# Altium schematic sheet Sensors.SchDoc
size A4; SheetNumber: 1; SheetTotal: 1
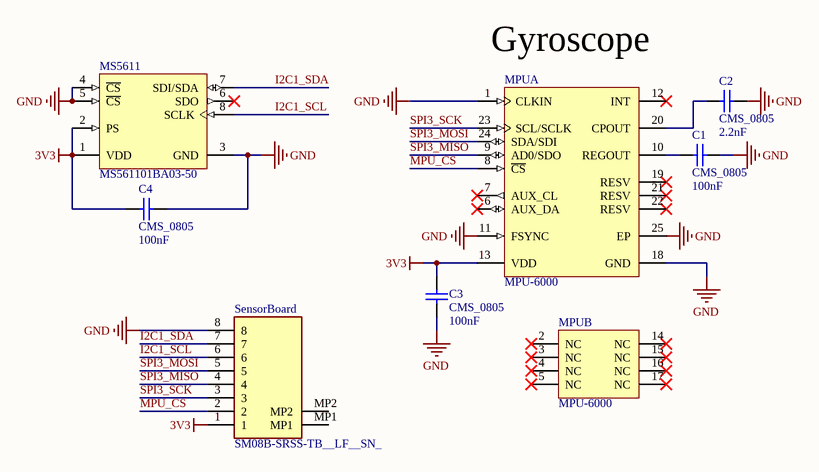
[diagram p0: Sensors.SchDoc]

## Parts
C1  value 100nF  [CONDENSATEUR_CMS_0805]  (hidden comment: CMS_0805)
C2  value 2.2nF  [CONDENSATEUR_CMS_0805]  (hidden comment: CMS_0805)
C3  value 100nF  [CONDENSATEUR_CMS_0805]  (hidden comment: CMS_0805)
C4  value 100nF  [CONDENSATEUR_CMS_0805]  (hidden comment: CMS_0805)
MPU  MPU-6000  [INSE-QFN-24_V]  (parts A,B of 2)
MS5611  MS561101BA03-50  [MSI-MS561101BA03-50-8_V]
SensorBoard  SM08B-SRSS-TB__LF__SN_  [SM08BSRSSTBLFSN]

## Nets
3V3: C3.2 C4.2 MPU.13(VDD) MS5611.1(VDD) MS5611.2(PS) SensorBoard.1
GND: C1.2 C2.2 C3.1 C4.1 MPU.1(CLKIN) MPU.11(FSYNC) MPU.18(GND) MPU.25(EP) MS5611.3(GND) MS5611.4(~{CS}) MS5611.5(~{CS}) SensorBoard.8
I2C1_SCL: MS5611.8(SCLK) SensorBoard.6
I2C1_SDA: MS5611.7(SDI/SDA) SensorBoard.7
MPU_CS: MPU.8(~{CS}) SensorBoard.2
SPI3_MISO: MPU.9(AD0/SDO) SensorBoard.4
SPI3_MOSI: MPU.24(SDA/SDI) SensorBoard.5
SPI3_SCK: MPU.23(SCL/SCLK) SensorBoard.3
NetC1_1: C1.1 MPU.10(REGOUT)
NetC2_1: C2.1 MPU.20(CPOUT)

Not connected (* = marked no-connect by the designer): MPU 2(NC)* 3(NC)* 4(NC)* 5(NC)* 6(AUX_DA)* 7(AUX_CL)* 12(INT)* 14(NC)* 15(NC)* 16(NC)* 17(NC)* 19(RESV)* 21(RESV)* 22(RESV)*; MS5611 6(SDO)*; SensorBoard MP1 MP2

## Notes on the sheet
- (near MPU) Gyroscope

## Library data of the parts
C1-C4 = CONDENSATEUR_CMS_CER_0805: CONDENSATEUR CMS CERAMIQUE 0805; Type: CMS_0805
MPU = CMP-2000-05008-1: 3-Axis Gyroscope 3-Axis Accelerometer Motion Processing Unit with I2C and SPI, 2.5, 3 or 3.3 V, -40 to 85 degC, 24-Pin QFN, RoHS, Tape and Reel; Manufacturer: InvenSense; Featured Product: MPU60006AxisIntegratedSPISolution; Output Type: I²C,SPI; Sensor Type: Accelerometer,Gyroscope,3Axis; Other Names: 1428-1005-2 / MPU6000; Online Catalog: MPU-6000™Series; Operating Temperature: -40degC~85degC(TA); Datasheet URL: https://www.invensense.com/wp-content/uploads/2015/02/MPU-6000-Datasheet1.pdf; Manufacturer URL: http://www.invensense.com/; Datasheet Version: Rev. 3.4, 08/2013; Standard Package: 5,000; Family: Multifunction; Package Reference: QFN-24; Category: Sensors,Transducers; Package Description: 24-Pin Quad Flat No-lead Package, Body 4 x 4 mm, Pitch 0.5 mm
MS5611 = CMP-2000-05251-1: Barometric Pressure Sensor, with Stainless Steel Cap, 1.8 to 3.6 V, -45 to 85 degC, 8-Pin QFN, RoHS, Tape and Reel; Manufacturer: Measurement Specialties; Operating Pressure Max: 1200mbar; Supply Current: 12.5µA; Supply Voltage Max: 3.6V; Supply Voltage Min: 1.8V; No. of Pins: 8; Connection Size: 0.5mm; SVHC: NoSVHC(20-Jun-2013); Operating Pressure Min: 10mbar; Manufacturer URL: http://www.meas-spec.com/; Operating Temperature Min: -40degC; Pressure Type: Barometric; Package Reference: MS561101BA03-50-8; Datasheet URL: http://www.te.com/commerce/DocumentDelivery/DDEController?Action=srchrtrv&DocNm=MS5611-01BA03&DocType=Data+Sheet&DocLang=English&DocFormat=pdf&PartCntxt=CAT-BLPS0036; Package Description: 8-Pin Surface Mount Device, Body 5 x 3 mm, Pitch 1.25 mm; Sensor Case Style: QFN; Datasheet Version: Sep-15; Operating Temperature Max: 85degC
SensorBoard = SM08B-SRSS-TB__LF__SN_: Connector; Manufacturer_Name: JST (JAPAN SOLDERLESS TERMINALS); Manufacturer_Part_Number: SM08B-SRSS-TB (LF)(SN); Datasheet Link: http://docs-emea.rs-online.com/webdocs/082f/0900766b8082f545.pdf; Height: 2.9mm; Arrow Part Number: SM08B-SRSS-TB (LF)(SN); Arrow Price/Stock: https://www.arrow.com/en/products/sm08b-srss-tb-lf-sn/jst-manufacturing